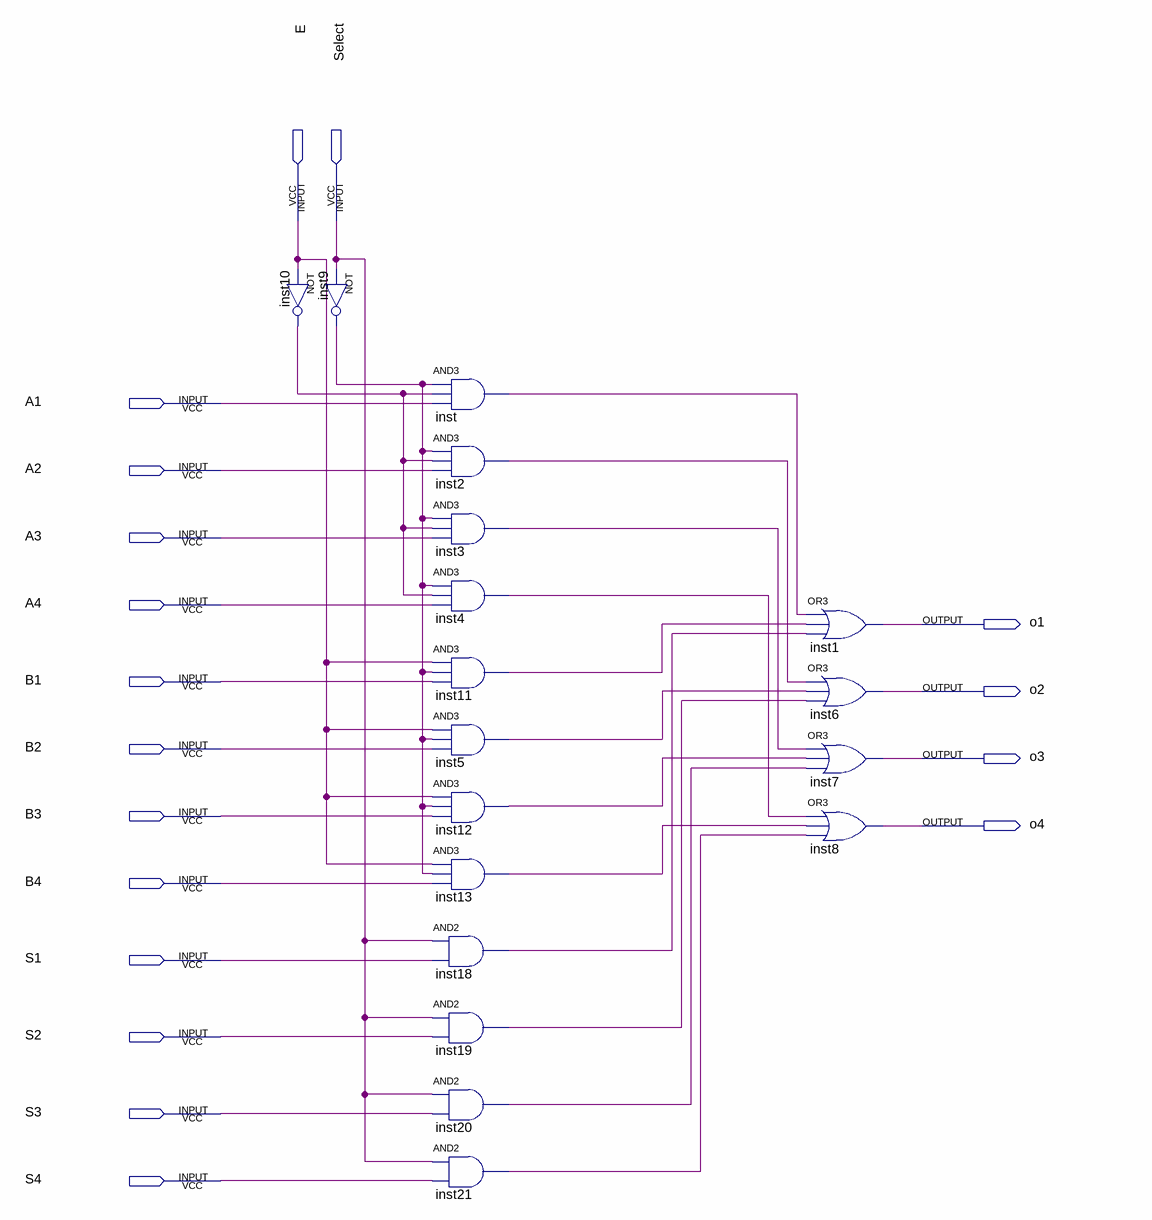
[diagram p0: schematic sheet]
// Quartus schematic 16mux4.bdf as structural Verilog: 18 symbols, 18 pins
module \16mux4  (
  input  E,
  input  Select,
  input  A1,
  input  A2,
  input  A3,
  input  A4,
  input  B1,
  input  B2,
  input  B3,
  input  B4,
  input  S1,
  input  S2,
  input  S3,
  input  S4,
  output o1,
  output o2,
  output o3,
  output o4
);

  wire inst2_out, inst3_out, inst4_out, inst5_out, inst9_out, inst10_out, inst11_out, inst12_out, inst13_out,
       inst18_out, inst19_out, inst20_out, inst21_out, inst_out;

  not inst9 (inst9_out, Select);
  not inst10 (inst10_out, E);
  and inst (inst_out, inst9_out, inst10_out, A1);
  and inst2 (inst2_out, inst9_out, inst10_out, A2);
  and inst3 (inst3_out, inst9_out, inst10_out, A3);
  and inst4 (inst4_out, inst9_out, inst10_out, A4);
  and inst11 (inst11_out, E, inst9_out, B1);
  and inst5 (inst5_out, E, inst9_out, B2);
  and inst12 (inst12_out, E, inst9_out, B3);
  and inst13 (inst13_out, E, inst9_out, B4);
  and inst18 (inst18_out, Select, S1);
  and inst19 (inst19_out, Select, S2);
  and inst20 (inst20_out, Select, S3);
  and inst21 (inst21_out, Select, S4);
  or inst1 (o1, inst_out, inst11_out, inst18_out);
  or inst6 (o2, inst2_out, inst5_out, inst19_out);
  or inst7 (o3, inst3_out, inst12_out, inst20_out);
  or inst8 (o4, inst4_out, inst13_out, inst21_out);
endmodule
